# EAGLE design Wemos_GYBMEP (EAGLE 6.5.0)
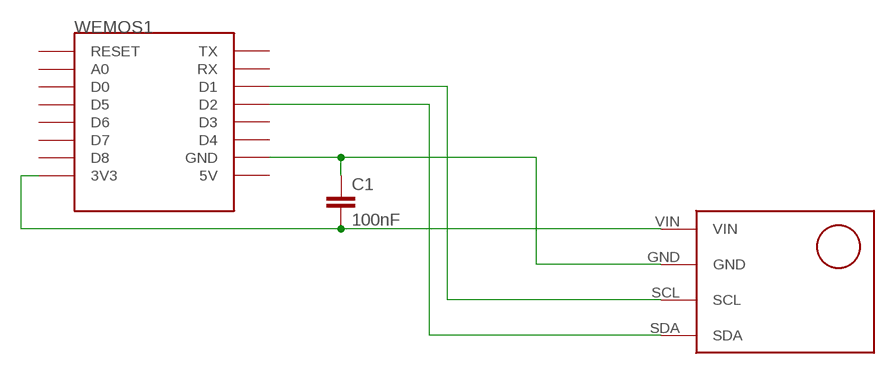
[diagram p0: schematic, sheet 1]

## Parts
C1  100nF  C-EU  [C5B2.5]
U$1  GYBMEP  [GYBMEP]
WEMOS1  WEMOS-D1-MINI  [WEMOS-D1-MINI]

## Nets
N$1: C1.2 U$1.VIN WEMOS1.3V3
N$2: C1.1 U$1.GND WEMOS1.GND
N$3: U$1.SCL WEMOS1.D1
N$4: U$1.SDA WEMOS1.D2
Unconnected: WEMOS1.5V WEMOS1.A0 WEMOS1.D0 WEMOS1.D3 WEMOS1.D4 WEMOS1.D5 WEMOS1.D6 WEMOS1.D7 WEMOS1.D8 WEMOS1.RESET WEMOS1.RX WEMOS1.TX

## Library data of the parts
C1 = Glenn:C-EU: CAPACITOR, European symbol
U$1 = Glenn:GYBMEP
WEMOS1 = Glenn:WEMOS-D1-MINI: WeMos.cc D1 mini ESP8266 module

## Board
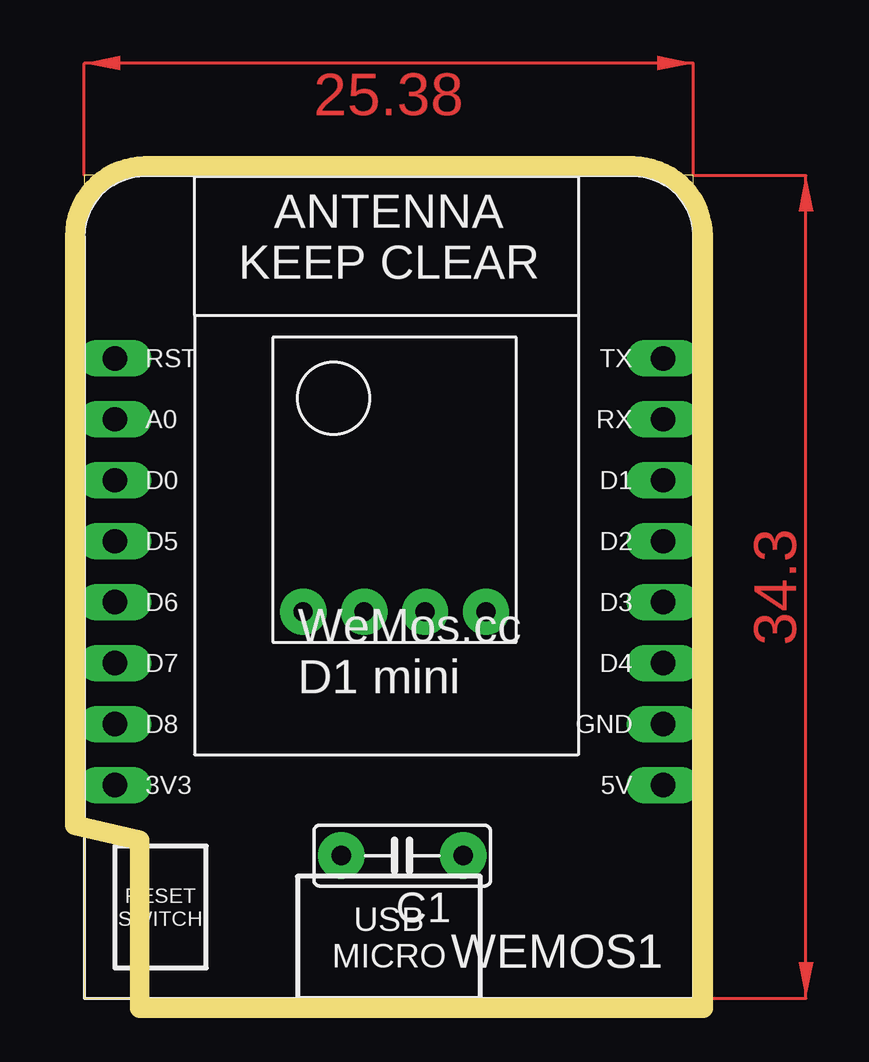
[diagram p1: board, top side]
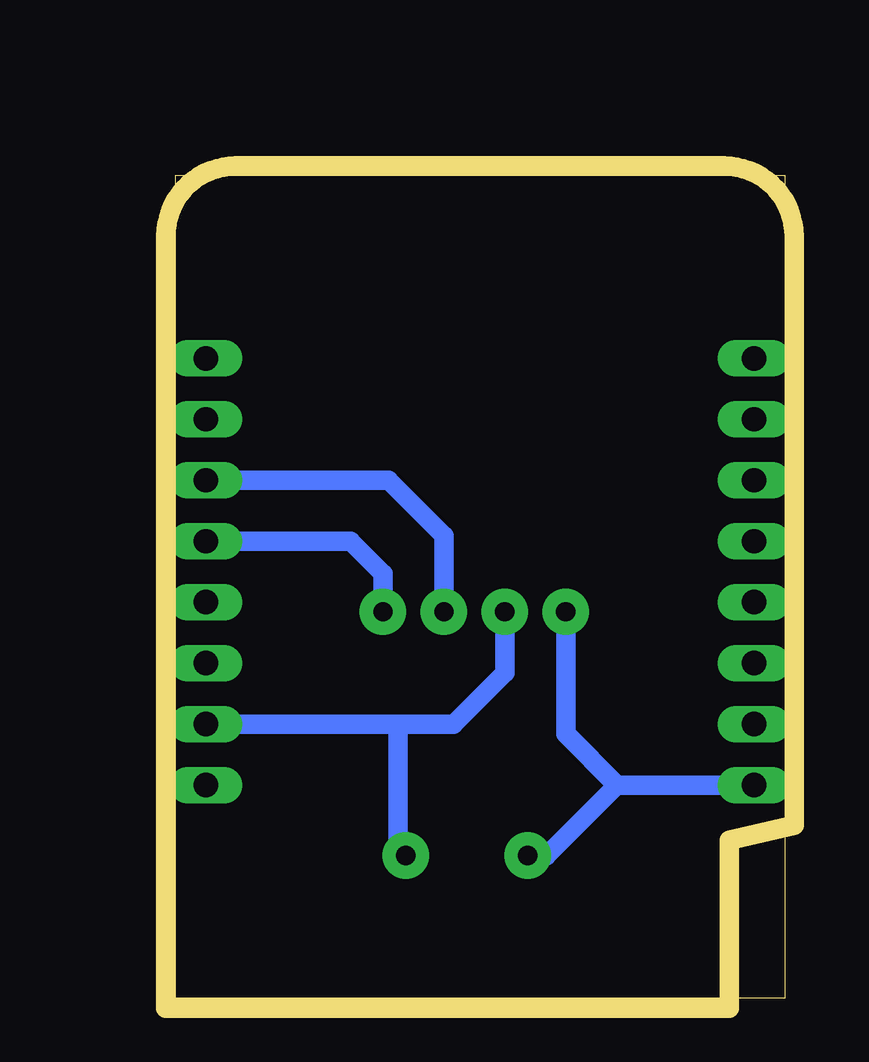
[diagram p2: board, bottom side, seen from below]

Size 25.38 x 34.3 mm. Coordinates in mm from the lower left corner, seen from the top.
Outline: 0,0 25.38,0 25.38,34.3 0,34.3 0,0
Copper layers (1*16): Top 0.035mm / dielectric 1.5mm / Bottom 0.035mm
Design rules "default *": minimum track width 16mil, minimum drill 24mil, track to track 20mil, track to pad 8mil, pad to pad 8mil, via to via 8mil, smd to smd 8mil, copper to edge 20mil, drill to drill 20mil, minimum pad ring 10mil, minimum via ring 8mil, stop-mask expansion 4mil, vias tented up to drill 0mil, thermal gap 10mil
Milling: 8 lines

### Footprints (pad centres in the part's own frame; a part is rotated, then mirrored left to right if it is on the bottom)
C5B2.5 = drill 0.813 pad 1.93: 1 -2.54,0; 2 2.54,0
GYBMEP = drill 0.8 pad 1.93: GND -3.81,1.27; SCL -3.81,-1.27; SDA -3.81,-3.81; VIN -3.81,3.81
WEMOS-D1-MINI = drill 1.016 pad 1.422 long: 3V3 -10.16,-10.16; 5V 12.7,-10.16; A0 -10.16,5.08; D0 -10.16,2.54; D1 12.7,2.54; D2 12.7,0; D3 12.7,-2.54; D4 12.7,-5.08; D5 -10.16,0; D6 -10.16,-2.54; D7 -10.16,-5.08; D8 -10.16,-7.62; GND 12.7,-7.62; RESET -10.16,7.62; RX 12.7,5.08; TX 12.7,7.62

### Placement (x,y rotation side)
C1  13.25,5.95 180 top
U$1  12.94,19.92 90 top
WEMOS1  11.43,19.05 0 top

### Tracks (layer width: path | path; a pad name or v marks a point on that pad's centre or on a via)
N$1
  Bottom 0.813: WEMOS1.3V3 6.98,8.89 | 6.98,8.89 9.12,11.03 U$1.VIN | C1.2 9.92,5.95 6.98,8.89
N$2
  Bottom 0.813: WEMOS1.GND 16.11,11.43 | 16.11,11.43 13.8,11.43 11.66,13.57 U$1.GND | C1.1 16.11,5.95 16.11,11.43
N$3
  Bottom 0.813: WEMOS1.D1 16.51,21.59 14.21,19.29 U$1.SCL
N$4
  Bottom 0.813: WEMOS1.D2 18.1,19.05 16.75,17.7 U$1.SDA
(copper drawn outside any net)
  shapes: Top area x2